# Altium schematic sheet Noise Diode power supply.SchDoc
size A
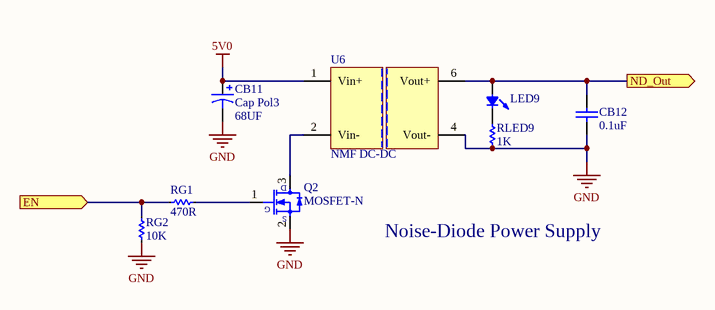
[diagram p0: Noise Diode power supply.SchDoc]

## Parts
CB11  Cap Pol3  value 68UF  [V]
CB12  value 0.1uF  [0603C]  (hidden comment: Cap Semi)
LED9  LED0  [T1 LED]  (value not drawn)
Q2  MOSFET-N  [SOT23-3N]
RG1  value 470R  [0603R]  (hidden comment: Res Semi Small)
RG2  value 10K  [0603R]  (hidden comment: Res Semi Small)
RLED9  value 1K  [0603R]  (hidden comment: Res Semi Small)
U6  NMF DC-DC  [SIL-6(A1)]

## Ports
EN (in), ND_Out (out)

## Nets
5V0: CB11.1 U6.1(Vin+)
GND: CB11.2 CB12.1 Q2.2(S) RG2.1 RLED9.2 U6.4(Vout-)
EN: RG1.1 RG2.2 ; port EN
ND_Out: CB12.2 LED9.1 U6.6(Vout+) ; port ND_Out
NetLED9_2: LED9.2 RLED9.1
NetQ2_1: Q2.1(G) RG1.2
NetQ2_3: Q2.3(D) U6.2(Vin-)

## Notes on the sheet
- Noise-Diode Power Supply

## Library data of the parts
CB11 = Cap Pol3: KEMET T520 KO-CAP  Polymer SMT Tantalum; DKPN: 399-3330-1-ND; Voltage: 10V; Type: KEMET T520 KO-CAP  Polymer SMT Tantalum
CB12 = Cap Semi: Capacitor (Semiconductor SIM Model); Published: 8-Jun-2000; LatestRevisionDate: 17-Jul-2002; LatestRevisionNote: Re-released for DXP Platform.; PackageReference: C1206; Publisher: Altium Limited
LED9 = LED0: T 1 3/4 LED; Published: 8-Jun-2000; LatestRevisionDate: 08-Jul-2005; LatestRevisionNote: Mech Layer 1 removed.; PackageReference: LED-0; Publisher: Altium Limited
Q2 = MOSFET-N: N-Channel MOSFET; Published: 8-Jun-2000; LatestRevisionDate: 17-Jul-2002; LatestRevisionNote: Re-released for DXP Platform.; PackageVersion: 1995/1996; PackageReference: E3; Publisher: Altium Limited
RG1 RG2 RLED9 = Res Semi Small: Semiconductor Resistor; Published: 8-Jun-2000; LatestRevisionDate: 17-Jul-2002; LatestRevisionNote: Re-released for DXP Platform.; PackageReference: AXIAL-0.5; Publisher: Altium Limited
U6 = Murata NMF DC-DC: Murata NMF DC-DC - 1W, Single output